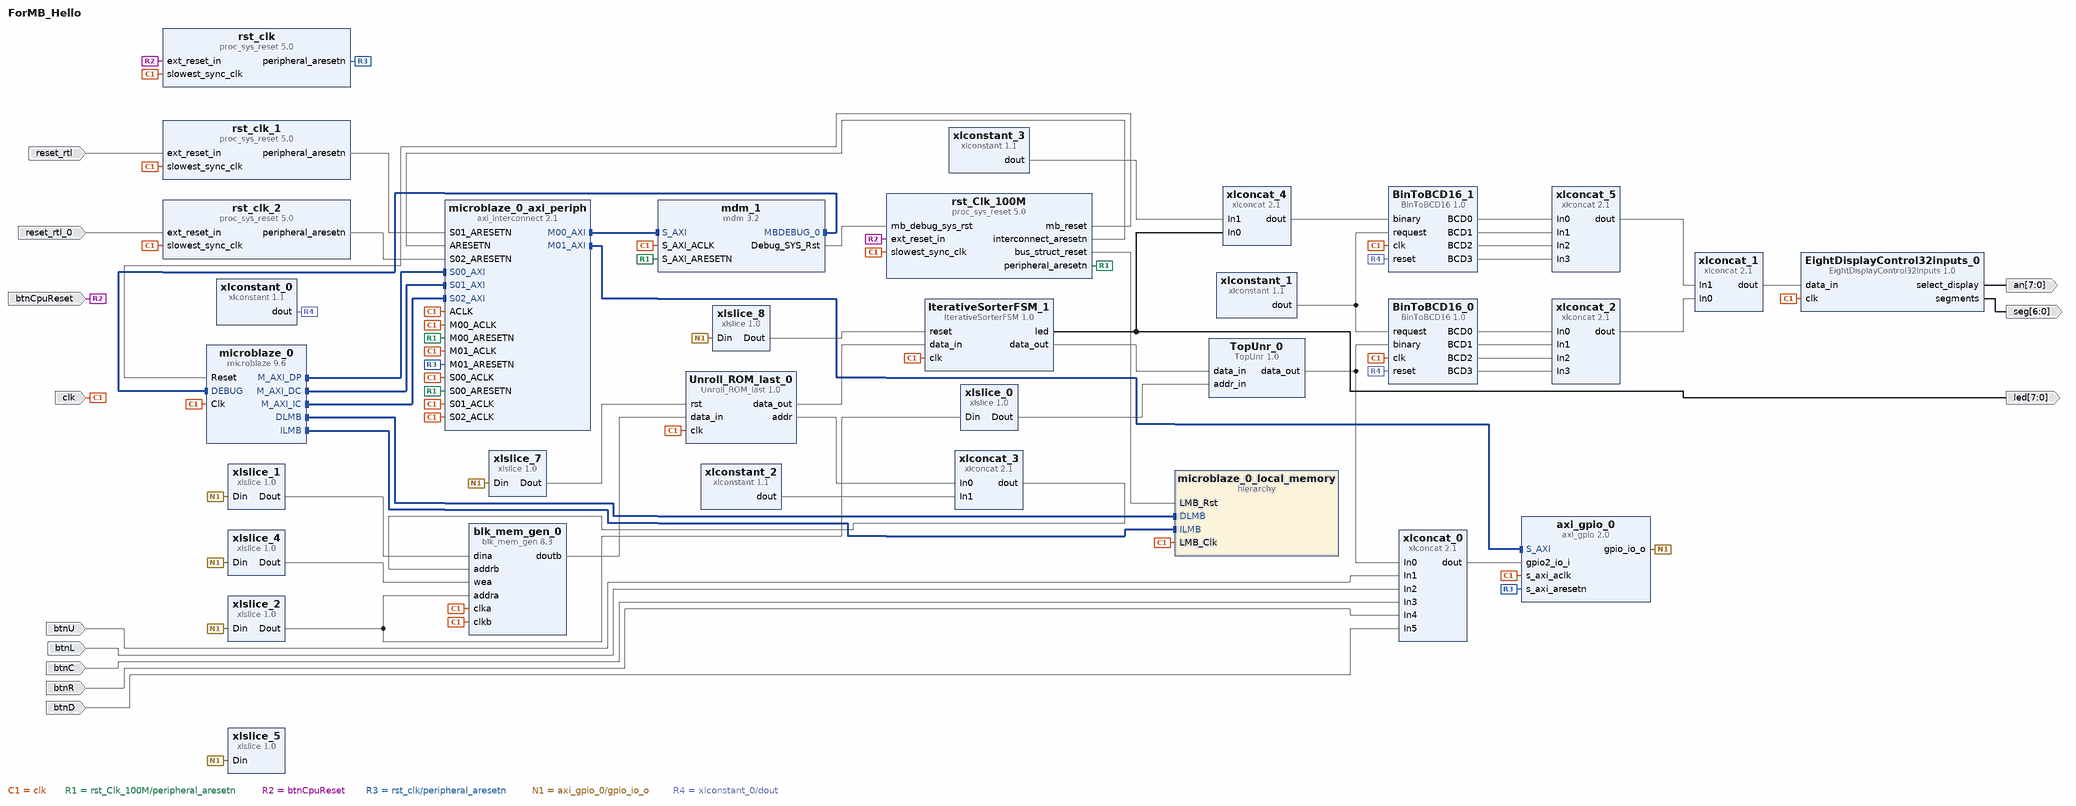
[diagram p0: block diagram of the top level]
# Vivado block design ForMB_Hello, Vivado 2016.1
create_bd_design ForMB_Hello

create_bd_port -dir I clk
create_bd_port -dir I btnCpuReset
create_bd_port -dir O -from 7 -to 0 an
create_bd_port -dir O -from 6 -to 0 seg
create_bd_port -dir I btnU
create_bd_port -dir I btnL
create_bd_port -dir I btnC
create_bd_port -dir I btnR
create_bd_port -dir I btnD
create_bd_port -dir O -from 7 -to 0 led
create_bd_port -dir I -type rst reset_rtl
set_property -dict {CONFIG.POLARITY ACTIVE_LOW} [get_bd_ports reset_rtl]
create_bd_port -dir I -type rst reset_rtl_0
set_property -dict {CONFIG.POLARITY ACTIVE_LOW} [get_bd_ports reset_rtl_0]

create_bd_cell -type hier microblaze_0_local_memory
create_bd_cell -type ip -vlnv ua.pt:user:BinToBCD16:1.0 BinToBCD16_0
create_bd_cell -type ip -vlnv ua.pt:user:Unroll_ROM_last:1.0 Unroll_ROM_last_0
set_property -dict {CONFIG.data_width 16 CONFIG.address_bits 7} [get_bd_cells Unroll_ROM_last_0]
create_bd_cell -type ip -vlnv ua.pt:user:TopUnr:1.0 TopUnr_0
set_property -dict {CONFIG.data_width 16 CONFIG.address_bits 7} [get_bd_cells TopUnr_0]
create_bd_cell -type ip -vlnv ua.pt:user:BinToBCD16:1.0 BinToBCD16_1
create_bd_cell -type ip -vlnv ua.pt:user:IterativeSorterFSM:1.0 IterativeSorterFSM_1
set_property -dict {CONFIG.L 128 CONFIG.M 16} [get_bd_cells IterativeSorterFSM_1]
create_bd_cell -type ip -vlnv ua.pt:user:EightDisplayControl32inputs:1.0 EightDisplayControl32inputs_0
create_bd_cell -type ip -vlnv xilinx.com:ip:axi_gpio:2.0 axi_gpio_0
set_property -dict [list \
  CONFIG.C_GPIO_WIDTH 32 \
  CONFIG.C_GPIO2_WIDTH 21 \
  CONFIG.C_IS_DUAL 1 \
  CONFIG.C_DOUT_DEFAULT 0xf0f0f0f0 \
  CONFIG.C_ALL_INPUTS_2 1 \
  CONFIG.C_ALL_OUTPUTS 1 \
] [get_bd_cells axi_gpio_0]
create_bd_cell -type ip -vlnv xilinx.com:ip:blk_mem_gen:8.3 blk_mem_gen_0
set_property -dict [list \
  CONFIG.Memory_Type Simple_Dual_Port_RAM \
  CONFIG.Enable_32bit_Address false \
  CONFIG.Use_Byte_Write_Enable false \
  CONFIG.Write_Width_A 16 \
  CONFIG.Write_Depth_A 256 \
  CONFIG.Operating_Mode_A NO_CHANGE \
  CONFIG.Enable_A Always_Enabled \
  CONFIG.Write_Width_B 16 \
  CONFIG.Read_Width_B 16 \
  CONFIG.Enable_B Always_Enabled \
  CONFIG.Register_PortB_Output_of_Memory_Primitives false \
  CONFIG.Fill_Remaining_Memory_Locations true \
  CONFIG.Remaining_Memory_Locations 2 \
  CONFIG.Port_A_Write_Rate 50 \
  CONFIG.Port_B_Clock 100 \
  CONFIG.Port_B_Enable_Rate 100 \
  CONFIG.use_bram_block Stand_Alone \
] [get_bd_cells blk_mem_gen_0]
create_bd_cell -type ip -vlnv xilinx.com:ip:mdm:3.2 mdm_1
set_property -dict {CONFIG.C_USE_UART 1} [get_bd_cells mdm_1]
create_bd_cell -type ip -vlnv xilinx.com:ip:microblaze:9.6 microblaze_0
set_property -dict [list \
  CONFIG.C_D_AXI 1 \
  CONFIG.C_D_LMB 1 \
  CONFIG.C_I_LMB 1 \
  CONFIG.C_ENABLE_DISCRETE_PORTS 0 \
  CONFIG.C_USE_DIV 1 \
  CONFIG.C_USE_HW_MUL 1 \
  CONFIG.C_USE_FPU 1 \
  CONFIG.C_DEBUG_ENABLED 1 \
  CONFIG.C_ICACHE_BASEADDR 0x20000000 \
  CONFIG.C_ICACHE_HIGHADDR 0x3FFFFFFF \
  CONFIG.C_USE_ICACHE 1 \
  CONFIG.C_ALLOW_ICACHE_WR 1 \
  CONFIG.C_CACHE_BYTE_SIZE 16384 \
  CONFIG.C_ICACHE_LINE_LEN 8 \
  CONFIG.C_ICACHE_FORCE_TAG_LUTRAM 1 \
  CONFIG.C_DCACHE_BASEADDR 0x0000000020000000 \
  CONFIG.C_USE_DCACHE 1 \
  CONFIG.C_DCACHE_BYTE_SIZE 16384 \
  CONFIG.C_DCACHE_LINE_LEN 8 \
] [get_bd_cells microblaze_0]
create_bd_cell -type ip -vlnv xilinx.com:ip:axi_interconnect:2.1 microblaze_0_axi_periph
set_property -dict {CONFIG.NUM_SI 3 CONFIG.NUM_MI 2} [get_bd_cells microblaze_0_axi_periph]
create_bd_cell -type ip -vlnv xilinx.com:ip:proc_sys_reset:5.0 rst_Clk_100M
create_bd_cell -type ip -vlnv xilinx.com:ip:proc_sys_reset:5.0 rst_clk
create_bd_cell -type ip -vlnv xilinx.com:ip:xlconcat:2.1 xlconcat_0
set_property -dict {CONFIG.NUM_PORTS 6 CONFIG.IN0_WIDTH 16 CONFIG.IN1_WIDTH 1 CONFIG.IN6_WIDTH 8} [get_bd_cells xlconcat_0]
create_bd_cell -type ip -vlnv xilinx.com:ip:xlconcat:2.1 xlconcat_1
set_property -dict {CONFIG.IN0_WIDTH 16 CONFIG.IN1_WIDTH 16} [get_bd_cells xlconcat_1]
create_bd_cell -type ip -vlnv xilinx.com:ip:xlconcat:2.1 xlconcat_2
set_property -dict [list \
  CONFIG.NUM_PORTS 4 \
  CONFIG.IN0_WIDTH 4 \
  CONFIG.IN1_WIDTH 4 \
  CONFIG.IN2_WIDTH 4 \
  CONFIG.IN3_WIDTH 4 \
] [get_bd_cells xlconcat_2]
create_bd_cell -type ip -vlnv xilinx.com:ip:xlconcat:2.1 xlconcat_3
set_property -dict {CONFIG.IN0_WIDTH 7 CONFIG.IN1_WIDTH 1} [get_bd_cells xlconcat_3]
create_bd_cell -type ip -vlnv xilinx.com:ip:xlconcat:2.1 xlconcat_4
set_property -dict {CONFIG.IN0_WIDTH 8 CONFIG.IN1_WIDTH 8} [get_bd_cells xlconcat_4]
create_bd_cell -type ip -vlnv xilinx.com:ip:xlconcat:2.1 xlconcat_5
set_property -dict [list \
  CONFIG.NUM_PORTS 4 \
  CONFIG.IN0_WIDTH 4 \
  CONFIG.IN1_WIDTH 4 \
  CONFIG.IN2_WIDTH 4 \
  CONFIG.IN3_WIDTH 4 \
] [get_bd_cells xlconcat_5]
create_bd_cell -type ip -vlnv xilinx.com:ip:xlconstant:1.1 xlconstant_0
set_property -dict {CONFIG.CONST_VAL 0} [get_bd_cells xlconstant_0]
create_bd_cell -type ip -vlnv xilinx.com:ip:xlconstant:1.1 xlconstant_1
create_bd_cell -type ip -vlnv xilinx.com:ip:xlconstant:1.1 xlconstant_2
set_property -dict {CONFIG.CONST_VAL 0} [get_bd_cells xlconstant_2]
create_bd_cell -type ip -vlnv xilinx.com:ip:xlconstant:1.1 xlconstant_3
set_property -dict {CONFIG.CONST_WIDTH 8 CONFIG.CONST_VAL 0} [get_bd_cells xlconstant_3]
create_bd_cell -type ip -vlnv xilinx.com:ip:xlslice:1.0 xlslice_0
set_property -dict {CONFIG.DIN_FROM 6 CONFIG.DIN_WIDTH 8} [get_bd_cells xlslice_0]
create_bd_cell -type ip -vlnv xilinx.com:ip:xlslice:1.0 xlslice_1
set_property -dict {CONFIG.DIN_FROM 15} [get_bd_cells xlslice_1]
create_bd_cell -type ip -vlnv xilinx.com:ip:xlslice:1.0 xlslice_2
set_property -dict {CONFIG.DIN_TO 16 CONFIG.DIN_FROM 23} [get_bd_cells xlslice_2]
create_bd_cell -type ip -vlnv xilinx.com:ip:xlslice:1.0 xlslice_4
set_property -dict {CONFIG.DIN_TO 31 CONFIG.DIN_FROM 31} [get_bd_cells xlslice_4]
create_bd_cell -type ip -vlnv xilinx.com:ip:xlslice:1.0 xlslice_5
set_property -dict {CONFIG.DIN_FROM 7} [get_bd_cells xlslice_5]
create_bd_cell -type ip -vlnv xilinx.com:ip:xlslice:1.0 xlslice_7
set_property -dict {CONFIG.DIN_TO 30 CONFIG.DIN_FROM 30} [get_bd_cells xlslice_7]
create_bd_cell -type ip -vlnv xilinx.com:ip:xlslice:1.0 xlslice_8
set_property -dict {CONFIG.DIN_TO 29 CONFIG.DIN_FROM 29} [get_bd_cells xlslice_8]
create_bd_cell -type ip -vlnv xilinx.com:ip:proc_sys_reset:5.0 rst_clk_1
create_bd_cell -type ip -vlnv xilinx.com:ip:proc_sys_reset:5.0 rst_clk_2

# ---- hierarchy /microblaze_0_local_memory ----
current_bd_instance /microblaze_0_local_memory
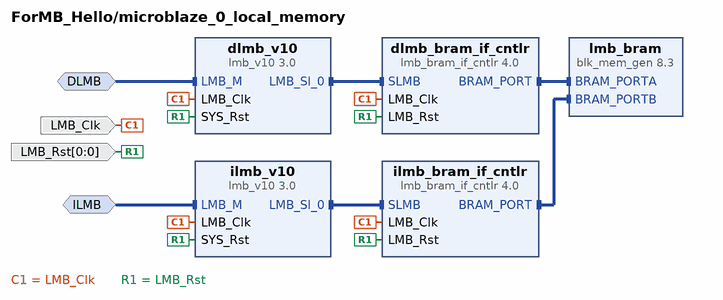
[diagram p1: block diagram inside /microblaze_0_local_memory]
create_bd_intf_pin -mode MirroredMaster -vlnv xilinx.com:interface:lmb_rtl:1.0 DLMB
create_bd_intf_pin -mode MirroredMaster -vlnv xilinx.com:interface:lmb_rtl:1.0 ILMB
create_bd_pin -dir I -type clk LMB_Clk
create_bd_pin -dir I -from 0 -to 0 -type rst LMB_Rst

create_bd_cell -type ip -vlnv xilinx.com:ip:lmb_bram_if_cntlr:4.0 dlmb_bram_if_cntlr
set_property -dict {CONFIG.C_ECC 0} [get_bd_cells dlmb_bram_if_cntlr]
create_bd_cell -type ip -vlnv xilinx.com:ip:lmb_v10:3.0 dlmb_v10
create_bd_cell -type ip -vlnv xilinx.com:ip:lmb_bram_if_cntlr:4.0 ilmb_bram_if_cntlr
set_property -dict {CONFIG.C_ECC 0} [get_bd_cells ilmb_bram_if_cntlr]
create_bd_cell -type ip -vlnv xilinx.com:ip:lmb_v10:3.0 ilmb_v10
create_bd_cell -type ip -vlnv xilinx.com:ip:blk_mem_gen:8.3 lmb_bram
set_property -dict {CONFIG.Memory_Type True_Dual_Port_RAM CONFIG.use_bram_block BRAM_Controller} [get_bd_cells lmb_bram]

# ---- connections ----

current_bd_instance /microblaze_0_local_memory
connect_bd_intf_net -intf_net microblaze_0_dlmb_bus [get_bd_intf_pins dlmb_v10/LMB_Sl_0] [get_bd_intf_pins dlmb_bram_if_cntlr/SLMB]
connect_bd_intf_net -intf_net microblaze_0_ilmb_bus [get_bd_intf_pins ilmb_v10/LMB_Sl_0] [get_bd_intf_pins ilmb_bram_if_cntlr/SLMB]
connect_bd_intf_net -intf_net microblaze_0_dlmb_cntlr [get_bd_intf_pins dlmb_bram_if_cntlr/BRAM_PORT] [get_bd_intf_pins lmb_bram/BRAM_PORTA]
connect_bd_intf_net -intf_net microblaze_0_ilmb_cntlr [get_bd_intf_pins ilmb_bram_if_cntlr/BRAM_PORT] [get_bd_intf_pins lmb_bram/BRAM_PORTB]
connect_bd_intf_net -intf_net microblaze_0_dlmb [get_bd_intf_pins DLMB] [get_bd_intf_pins dlmb_v10/LMB_M]
connect_bd_intf_net -intf_net microblaze_0_ilmb [get_bd_intf_pins ILMB] [get_bd_intf_pins ilmb_v10/LMB_M]
connect_bd_net -net microblaze_0_Clk [get_bd_pins LMB_Clk] \
  [get_bd_pins dlmb_bram_if_cntlr/LMB_Clk] [get_bd_pins dlmb_v10/LMB_Clk] [get_bd_pins ilmb_bram_if_cntlr/LMB_Clk] \
  [get_bd_pins ilmb_v10/LMB_Clk]
connect_bd_net -net microblaze_0_LMB_Rst [get_bd_pins LMB_Rst] \
  [get_bd_pins dlmb_bram_if_cntlr/LMB_Rst] [get_bd_pins dlmb_v10/SYS_Rst] [get_bd_pins ilmb_bram_if_cntlr/LMB_Rst] \
  [get_bd_pins ilmb_v10/SYS_Rst]

current_bd_instance /
connect_bd_intf_net [get_bd_intf_pins microblaze_0/DLMB] [get_bd_intf_pins microblaze_0_local_memory/DLMB]
connect_bd_intf_net [get_bd_intf_pins microblaze_0/ILMB] [get_bd_intf_pins microblaze_0_local_memory/ILMB]
connect_bd_intf_net -intf_net microblaze_0_axi_dp [get_bd_intf_pins microblaze_0_axi_periph/S00_AXI] [get_bd_intf_pins microblaze_0/M_AXI_DP]
connect_bd_intf_net [get_bd_intf_pins mdm_1/MBDEBUG_0] [get_bd_intf_pins microblaze_0/DEBUG]
connect_bd_intf_net -intf_net microblaze_0_mdm_axi [get_bd_intf_pins microblaze_0_axi_periph/M00_AXI] [get_bd_intf_pins mdm_1/S_AXI]
connect_bd_intf_net [get_bd_intf_pins microblaze_0_axi_periph/M01_AXI] [get_bd_intf_pins axi_gpio_0/S_AXI]
connect_bd_intf_net [get_bd_intf_pins microblaze_0/M_AXI_DC] [get_bd_intf_pins microblaze_0_axi_periph/S01_AXI]
connect_bd_intf_net [get_bd_intf_pins microblaze_0/M_AXI_IC] [get_bd_intf_pins microblaze_0_axi_periph/S02_AXI]
connect_bd_net -net microblaze_0_Clk [get_bd_ports clk] \
  [get_bd_pins BinToBCD16_0/clk] [get_bd_pins Unroll_ROM_last_0/clk] [get_bd_pins BinToBCD16_1/clk] \
  [get_bd_pins microblaze_0_local_memory/LMB_Clk] [get_bd_pins IterativeSorterFSM_1/clk] \
  [get_bd_pins EightDisplayControl32inputs_0/clk] [get_bd_pins axi_gpio_0/s_axi_aclk] [get_bd_pins blk_mem_gen_0/clka] \
  [get_bd_pins blk_mem_gen_0/clkb] [get_bd_pins mdm_1/S_AXI_ACLK] [get_bd_pins microblaze_0/Clk] \
  [get_bd_pins microblaze_0_axi_periph/ACLK] [get_bd_pins microblaze_0_axi_periph/S00_ACLK] \
  [get_bd_pins microblaze_0_axi_periph/M00_ACLK] [get_bd_pins microblaze_0_axi_periph/M01_ACLK] \
  [get_bd_pins rst_Clk_100M/slowest_sync_clk] [get_bd_pins rst_clk/slowest_sync_clk] \
  [get_bd_pins microblaze_0_axi_periph/S01_ACLK] [get_bd_pins rst_clk_1/slowest_sync_clk] \
  [get_bd_pins microblaze_0_axi_periph/S02_ACLK] [get_bd_pins rst_clk_2/slowest_sync_clk]
connect_bd_net [get_bd_pins rst_Clk_100M/mb_reset] [get_bd_pins microblaze_0/Reset]
connect_bd_net [get_bd_pins rst_Clk_100M/bus_struct_reset] [get_bd_pins microblaze_0_local_memory/LMB_Rst]
connect_bd_net [get_bd_pins rst_Clk_100M/interconnect_aresetn] [get_bd_pins microblaze_0_axi_periph/ARESETN]
connect_bd_net [get_bd_pins rst_Clk_100M/peripheral_aresetn] \
  [get_bd_pins mdm_1/S_AXI_ARESETN] [get_bd_pins microblaze_0_axi_periph/S00_ARESETN] \
  [get_bd_pins microblaze_0_axi_periph/M00_ARESETN]
connect_bd_net [get_bd_pins mdm_1/Debug_SYS_Rst] [get_bd_pins rst_Clk_100M/mb_debug_sys_rst]
connect_bd_net [get_bd_ports btnCpuReset] [get_bd_pins rst_Clk_100M/ext_reset_in] [get_bd_pins rst_clk/ext_reset_in]
connect_bd_net [get_bd_pins rst_clk/peripheral_aresetn] [get_bd_pins axi_gpio_0/s_axi_aresetn] [get_bd_pins microblaze_0_axi_periph/M01_ARESETN]
connect_bd_net [get_bd_pins EightDisplayControl32inputs_0/select_display] [get_bd_ports an]
connect_bd_net [get_bd_pins EightDisplayControl32inputs_0/segments] [get_bd_ports seg]
connect_bd_net [get_bd_pins xlconcat_0/dout] [get_bd_pins axi_gpio_0/gpio2_io_i]
connect_bd_net [get_bd_ports btnU] [get_bd_pins xlconcat_0/In1]
connect_bd_net [get_bd_ports btnL] [get_bd_pins xlconcat_0/In2]
connect_bd_net [get_bd_ports btnC] [get_bd_pins xlconcat_0/In3]
connect_bd_net [get_bd_ports btnR] [get_bd_pins xlconcat_0/In4]
connect_bd_net [get_bd_ports btnD] [get_bd_pins xlconcat_0/In5]
connect_bd_net [get_bd_pins xlslice_1/Dout] [get_bd_pins blk_mem_gen_0/dina]
connect_bd_net [get_bd_pins xlslice_4/Dout] [get_bd_pins blk_mem_gen_0/wea]
connect_bd_net [get_bd_pins xlconcat_1/dout] [get_bd_pins EightDisplayControl32inputs_0/data_in]
connect_bd_net [get_bd_pins axi_gpio_0/gpio_io_o] \
  [get_bd_pins xlslice_1/Din] [get_bd_pins xlslice_2/Din] [get_bd_pins xlslice_4/Din] [get_bd_pins xlslice_5/Din] \
  [get_bd_pins xlslice_7/Din] [get_bd_pins xlslice_8/Din]
connect_bd_net [get_bd_pins BinToBCD16_0/BCD0] [get_bd_pins xlconcat_2/In0]
connect_bd_net [get_bd_pins BinToBCD16_0/BCD1] [get_bd_pins xlconcat_2/In1]
connect_bd_net [get_bd_pins BinToBCD16_0/BCD2] [get_bd_pins xlconcat_2/In2]
connect_bd_net [get_bd_pins BinToBCD16_0/BCD3] [get_bd_pins xlconcat_2/In3]
connect_bd_net [get_bd_pins xlconstant_0/dout] [get_bd_pins BinToBCD16_0/reset] [get_bd_pins BinToBCD16_1/reset]
connect_bd_net [get_bd_pins xlconstant_1/dout] [get_bd_pins BinToBCD16_0/request] [get_bd_pins BinToBCD16_1/request]
connect_bd_net [get_bd_pins xlconcat_2/dout] [get_bd_pins xlconcat_1/In0]
connect_bd_net [get_bd_pins xlslice_7/Dout] [get_bd_pins Unroll_ROM_last_0/rst]
connect_bd_net [get_bd_pins xlconcat_3/dout] [get_bd_pins blk_mem_gen_0/addrb]
connect_bd_net [get_bd_pins Unroll_ROM_last_0/addr] [get_bd_pins xlconcat_3/In0]
connect_bd_net [get_bd_pins xlconstant_2/dout] [get_bd_pins xlconcat_3/In1]
connect_bd_net [get_bd_pins blk_mem_gen_0/doutb] [get_bd_pins Unroll_ROM_last_0/data_in]
connect_bd_net [get_bd_pins TopUnr_0/data_out] [get_bd_pins BinToBCD16_0/binary] [get_bd_pins xlconcat_0/In0]
connect_bd_net [get_bd_pins Unroll_ROM_last_0/data_out] [get_bd_pins IterativeSorterFSM_1/data_in]
connect_bd_net [get_bd_pins xlslice_8/Dout] [get_bd_pins IterativeSorterFSM_1/reset]
connect_bd_net [get_bd_pins xlconcat_4/dout] [get_bd_pins BinToBCD16_1/binary]
connect_bd_net [get_bd_pins BinToBCD16_1/BCD0] [get_bd_pins xlconcat_5/In0]
connect_bd_net [get_bd_pins BinToBCD16_1/BCD1] [get_bd_pins xlconcat_5/In1]
connect_bd_net [get_bd_pins BinToBCD16_1/BCD2] [get_bd_pins xlconcat_5/In2]
connect_bd_net [get_bd_pins BinToBCD16_1/BCD3] [get_bd_pins xlconcat_5/In3]
connect_bd_net [get_bd_pins xlconstant_3/dout] [get_bd_pins xlconcat_4/In1]
connect_bd_net [get_bd_pins xlconcat_5/dout] [get_bd_pins xlconcat_1/In1]
connect_bd_net [get_bd_pins xlslice_0/Dout] [get_bd_pins TopUnr_0/addr_in]
connect_bd_net [get_bd_pins xlslice_2/Dout] [get_bd_pins blk_mem_gen_0/addra] [get_bd_pins xlslice_0/Din]
connect_bd_net [get_bd_pins IterativeSorterFSM_1/data_out] [get_bd_pins TopUnr_0/data_in]
connect_bd_net [get_bd_pins IterativeSorterFSM_1/led] [get_bd_ports led] [get_bd_pins xlconcat_4/In0]
connect_bd_net [get_bd_pins rst_clk_1/peripheral_aresetn] [get_bd_pins microblaze_0_axi_periph/S01_ARESETN]
connect_bd_net [get_bd_pins rst_clk_2/peripheral_aresetn] [get_bd_pins microblaze_0_axi_periph/S02_ARESETN]
connect_bd_net [get_bd_ports reset_rtl] [get_bd_pins rst_clk_1/ext_reset_in]
connect_bd_net -net reset_rtl_0_1 [get_bd_ports reset_rtl_0] [get_bd_pins rst_clk_2/ext_reset_in]

# ---- address map ----
assign_bd_address -offset 0x00000000 -range 8K -target_address_space [get_bd_addr_spaces microblaze_0/Data] [get_bd_addr_segs microblaze_0_local_memory/dlmb_bram_if_cntlr/SLMB/Mem]
assign_bd_address -offset 0x40000000 -range 64K -target_address_space [get_bd_addr_spaces microblaze_0/Data] [get_bd_addr_segs axi_gpio_0/S_AXI/Reg]
assign_bd_address -offset 0x41400000 -range 4K -target_address_space [get_bd_addr_spaces microblaze_0/Data] [get_bd_addr_segs mdm_1/S_AXI/Reg]
assign_bd_address -offset 0x00000000 -range 8K -target_address_space [get_bd_addr_spaces microblaze_0/Instruction] [get_bd_addr_segs microblaze_0_local_memory/ilmb_bram_if_cntlr/SLMB/Mem]
assign_bd_address -offset 0x40000000 -range 64K -target_address_space [get_bd_addr_spaces microblaze_0/Instruction] [get_bd_addr_segs axi_gpio_0/S_AXI/Reg]
assign_bd_address -offset 0x41400000 -range 4K -target_address_space [get_bd_addr_spaces microblaze_0/Instruction] [get_bd_addr_segs mdm_1/S_AXI/Reg]

validate_bd_design
save_bd_design
